# EAGLE design LOXpixel (EAGLE 9.3.0)
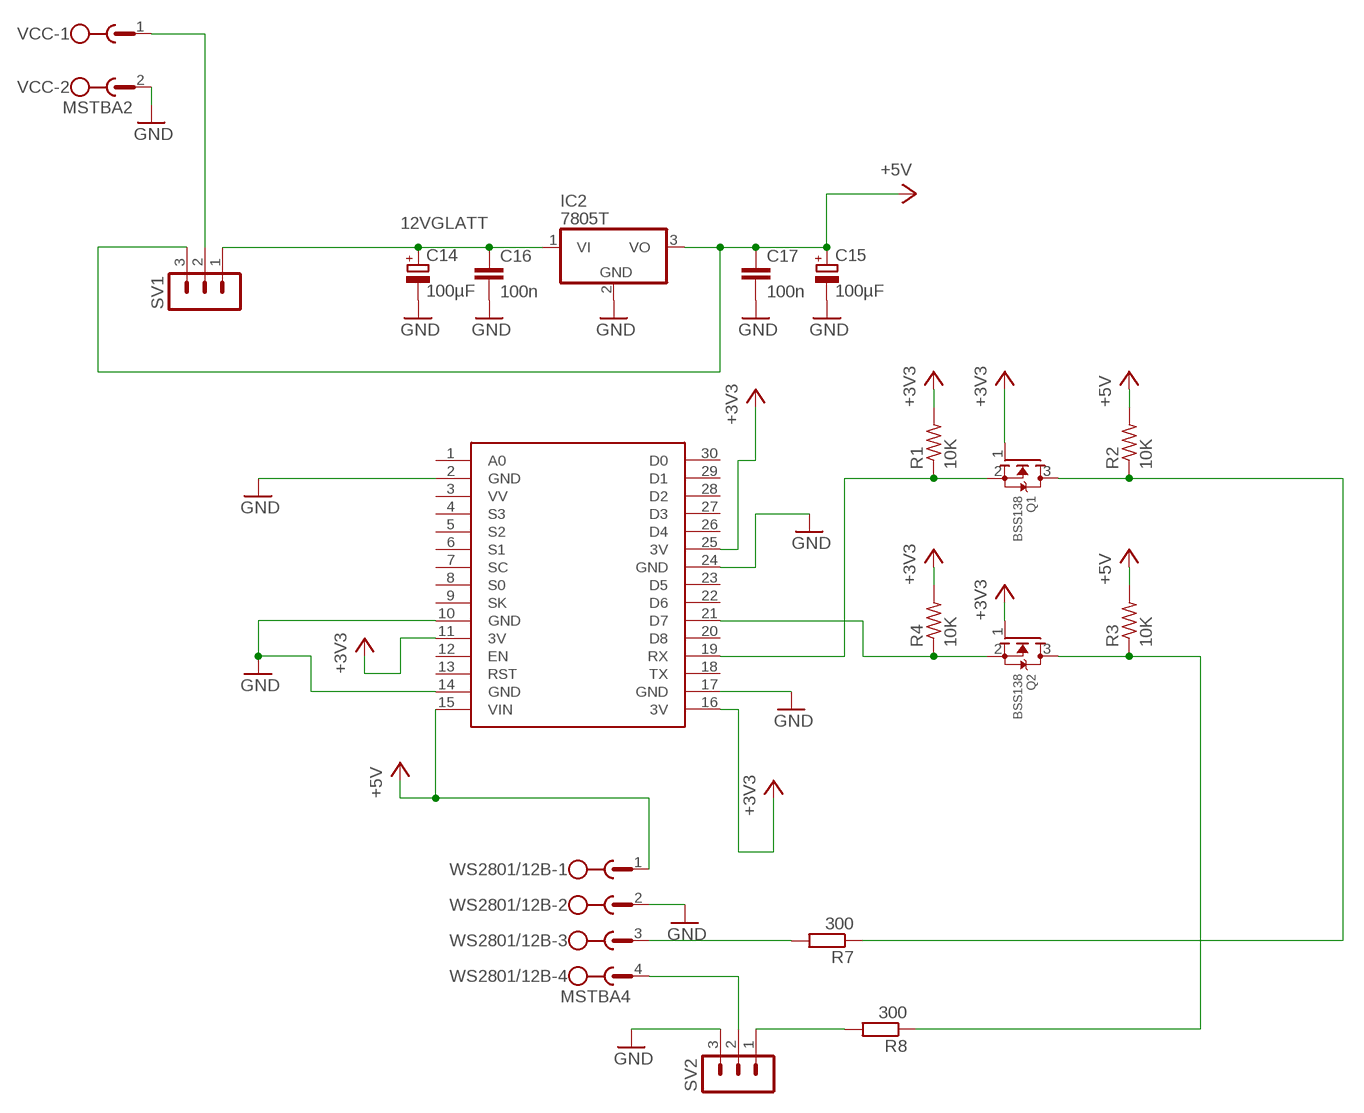
[diagram p0: schematic, sheet 1]

## Parts
C14  100µF  CPOL-EU150CLZ-0810  [150CLZ-0810]
C15  100µF  CPOL-EU150CLZ-0810  [150CLZ-0810]
C16  100n  C-EUC0805  [C0805]
C17  100n  C-EUC0805  [C0805]
IC2  7805T  [TO220H]
Q1  BSS138  MOSFET-NREFLOW  [SOT23]
Q2  BSS138  MOSFET-NREFLOW  [SOT23]
R1  10K  R-US_R0805  [R0805]
R2  10K  R-US_R0805  [R0805]
R3  10K  R-US_R0805  [R0805]
R4  10K  R-US_R0805  [R0805]
R7  300  R-EU_R0805  [R0805]
R8  300  R-EU_R0805  [R0805]
SV1  MA03-1  [MA03-1]
SV2  MA03-1  [MA03-1]
U$1  NODEMCU  [NODEMCU]
VCC  MSTBA2  [MSTBA2]
WS2801/12B  MSTBA4  [MSTBA4]

## Nets
12VGLATT: C14.+ C16.1 IC2.1(VI) SV1.1
+3V3: Q1.1(G) Q2.1(G) R1.2 R4.2 U$1.11(3V) U$1.16(3V) U$1.25(3V)
+5V: C15.+ C17.1 IC2.3(VO) R2.2 R3.2 SV1.3 U$1.15(VIN) WS2801/12B.1
GND: C14.- C15.- C16.2 C17.2 IC2.2(GND) SV2.3 U$1.2(GND) U$1.10(GND) U$1.14(GND) U$1.17(GND) U$1.24(GND) VCC.2 WS2801/12B.2
N$2: SV1.2 VCC.1
N$4: SV2.2 WS2801/12B.4
N$5: R8.2 SV2.1
N$6: R7.2 WS2801/12B.3
N$7: Q1.2(S) R1.1 U$1.19(RX)
N$8: Q1.3(D) R2.1 R7.1
N$11: Q2.2(S) R4.1 U$1.21(D7)
N$12: Q2.3(D) R3.1 R8.1
Unconnected: U$1.1(A0) U$1.3(VV) U$1.4(S3) U$1.5(S2) U$1.6(S1) U$1.7(SC) U$1.8(S0) U$1.9(SK) U$1.12(EN) U$1.13(RST) U$1.18(TX) U$1.20(D8) U$1.22(D6) U$1.23(D5) U$1.26(D4) U$1.27(D3) U$1.28(D2) U$1.29(D1) U$1.30(D0)

## Library data of the parts
C14 C15 = rcl:CPOL-EU: POLARIZED CAPACITOR, European symbol
C16 C17 = rcl:C-EU: CAPACITOR, European symbol
IC2 = linear:78*: Positive VOLTAGE REGULATOR Source: http://cache.national.com/ds/LM/LM78L05.pdf http://www.fairchildsemi.com/ds/LM/LM7805.pdf
Q1 Q2 = adafruit:MOSFET-N: N-Channel Mosfet 2N7002E - 60V 260mA SOT23 [Digikey: 2N7002ET1GOSTR-ND] - REEL BSH103 - 30V 850mA SOT23 [Digikey: 568-5013-1-ND]
R1-R4 = adafruit:R-US_: RESISTOR, American symbol
R7 R8 = rcl:R-EU_: RESISTOR, European symbol
SV1 SV2 = con-lstb:MA03-1: PIN HEADER; OC_FARNELL: unknown; OC_NEWARK: unknown
U$1 = nodemcu:NODEMCU
VCC = con-phoenix-508:MSTBA2: PHOENIX; MF: FARNELL; MPN: 1757242; OC_FARNELL: 3705171; OC_NEWARK: 71C4161
WS2801/12B = con-phoenix-508:MSTBA4: PHOENIX; MF: FARNELL; MPN: 1757268; OC_FARNELL: 3705195; OC_NEWARK: 71C4163

## Board
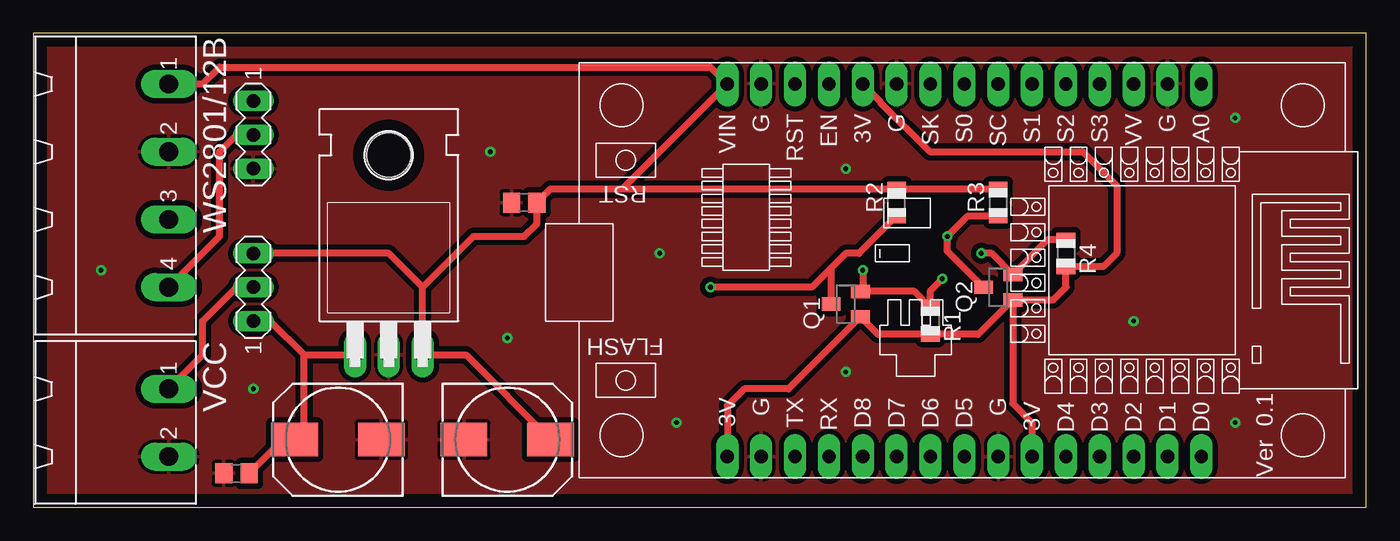
[diagram p1: board, top side]
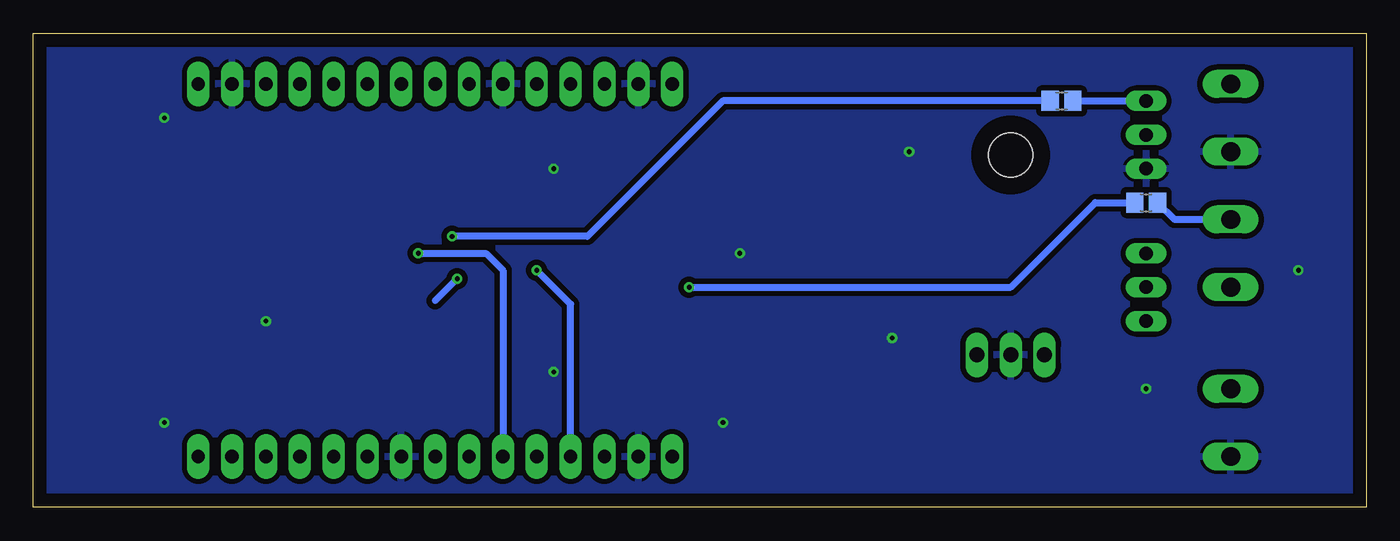
[diagram p2: board, bottom side, seen from below]

Size 100 x 35.55 mm. Coordinates in mm from the lower left corner, seen from the top.
Outline: 0,0 100,0 100,35.55 0,35.55 0,0
Copper layers (1*16): Top 0.035mm / dielectric 1.5mm / Bottom 0.035mm
Design rules "default": minimum track width 6mil, minimum drill 0.35mm, track to track 6mil, track to pad 6mil, pad to pad 6mil, via to via 6mil, smd to smd 6mil, copper to edge 40mil, drill to drill 6mil, minimum pad ring 10mil, minimum via ring 8mil, stop-mask expansion 4mil, vias tented up to drill 0mil, thermal gap 10mil

### Footprints (pad centres in the part's own frame; a part is rotated, then mirrored left to right if it is on the bottom)
150CLZ-0810 = smd 3.5 x 2.5: + 3.25,0; - -3.25,0
C0805 = smd 1.3 x 1.5: 1 -0.95,0; 2 0.95,0
TO220H = drill 1.118 long: 1 -2.54,-10.16; 2 0,-10.16; 3 2.54,-10.16 | hole 3.302: 0,4.826
SOT23 = smd 1 x 1.4: 1 -0.95,-1.1; 2 0.95,-1.1; 3 0,1.1
R0805 = smd 1.1 x 1.4: 1 -1,0; 2 1,0
R0805' = smd 1.3 x 1.5: 1 -0.85,0; 2 0.85,0
MA03-1 = drill 1.016 long: 1 -2.54,0; 2 0,0; 3 2.54,0
NODEMCU = drill 1 pad 1.676 long: 1 -13.97,17.78; 2 -13.97,15.24; 3 -13.97,12.7; 4 -13.97,10.16; 5 -13.97,7.62; 6 -13.97,5.08; 7 -13.97,2.54; 8 -13.97,0; 9 -13.97,-2.54; 10 -13.97,-5.08; 11 -13.97,-7.62; 12 -13.97,-10.16; 13 -13.97,-12.7; 14 -13.97,-15.24; 15 -13.97,-17.78; 16 13.97,-17.78; 17 13.97,-15.24; 18 13.97,-12.7; 19 13.97,-10.16; 20 13.97,-7.62; 21 13.97,-5.08; 22 13.97,-2.54; 23 13.97,0; 24 13.97,2.54; 25 13.97,5.08; 26 13.97,7.62; 27 13.97,10.16; 28 13.97,12.7; 29 13.97,15.24; 30 13.97,17.78
MSTBA2 = drill 1.397 long: 1 -2.54,5.08; 2 2.54,5.08
MSTBA4 = drill 1.397 long: 1 -7.62,5.08; 2 -2.54,5.08; 3 2.54,5.08; 4 7.62,5.08

### Placement (x,y rotation side)
C14  22.86,5.08 180 top
C15  35.56,5.08 0 top
C16  15.24,2.54 180 top
C17  36.83,22.86 180 top
IC2  26.67,21.59 0 top
Q1  60.96,15.24 90 top
Q2  72.39,16.51 90 top
R1  67.31,13.97 270 top
R2  64.77,22.86 90 top
R3  72.39,22.86 90 top
R4  77.47,19.05 270 top
R7  300  [R0805']  16.51,22.86 0 bottom
R8  300  [R0805']  22.86,30.48 0 bottom
SV1  16.51,16.51 90 top
SV2  16.51,27.94 270 top
U$1  69.85,17.78 270 top
VCC  5.08,6.35 270 top
WS2801/12B  5.08,24.13 270 top

### Tracks (layer width: path | path; a pad name or v marks a point on that pad's centre or on a via)
12VGLATT
  Top 0.508: SV1.1 17.78,13.97 20.32,11.43 | 20.32,11.43 IC2.1 | C14.+ 19.96,5.43 | 19.96,5.43 20.32,5.79 20.32,11.43 | C16.1 19.09,5.43 19.96,5.43
+3V3
  Top 0.508: Q2.1 73.49,7.79 74.93,6.35 U$1.25 | Q2.1 70.9,12.97 R1.2 63.38,12.97 Q1.1 56.66,8.89 53.34,8.89 52.07,7.62 U$1.16 | Q2.1 76.52,15.56 77.47,16.51 R4.2 80.28,18.05 81.28,19.05 81.28,24.13 78.74,26.67 67.25,26.67 63.52,30.4 63.52,30.45 U$1.11
+5V
  Top 0.508: R3.2 R2.2 44.18,23.86 | C15.+ 32.46,11.43 IC2.3 29.21,16.51 | 29.21,16.51 26.67,19.05 SV1.3 | 29.21,16.51 33.02,20.32 36.83,20.32 37.78,21.27 C17.1 38.78,23.86 43.18,23.86 44.18,23.86 | WS2801/12B.1 12.7,31.75 13.97,33.02 50.8,33.02 U$1.15 44.18,23.86
GND  (via drill 0.35)
  other vias: 16.51,8.89 5.08,17.78 34.29,26.67 35.56,12.7 48.26,6.35 46.99,19.05 60.96,25.4 60.96,10.16 82.55,13.97 90.17,6.35 90.17,29.21
  pour Top (isolate 0.406): 0,35.56 0,0 99.95,0 99.95,35.56
  pour Bottom (isolate 0.406): 0,35.56 0,0 99.95,0 99.95,35.56
N$2
  Top 0.508: VCC.1 12.7,11.43 12.7,13.97 15.24,16.51 SV1.2
N$4
  Top 0.508: WS2801/12B.4 13.97,20.32 13.97,26.67 15.24,27.94 SV2.2
N$5
  Bottom 0.508: R8.2 SV2.1
N$6
  Bottom 0.508: R7.2 14.39,21.59 WS2801/12B.3
N$7  (via drill 0.35)
  Top 0.508: 62.23,16.19 66.09,16.19 R1.1 67.31,16.26 v68.2,17.14 | 62.23,16.19 Q1.2 | v62.23,17.78 62.23,16.19
  Bottom 0.508: v68.2,17.14 69.85,15.49 | U$1.19 59.69,15.24 v62.23,17.78
N$8  (via drill 0.35)
  Top 0.508: R2.1 61.96,19.05 60.96,19.05 59.86,17.95 | 59.86,17.95 Q1.3 | 59.86,17.95 58.42,16.51 v50.8,16.51
  Bottom 0.508: v50.8,16.51 26.67,16.51 20.32,22.86 R7.1
N$11  (via drill 0.35)
  Top 0.508: R4.1 76.08,20.05 Q2.2 71.9,19.05 v71.12,19.05
  Bottom 0.508: v71.12,19.05 66.04,19.05 64.77,17.78 U$1.21
N$12  (via drill 0.35)
  Top 0.508: R3.1 70.12,21.86 v68.58,20.32 68.58,19.22 Q2.3
  Bottom 0.508: v68.58,20.32 58.42,20.32 48.26,30.48 R8.1

### Text on the board
bValues: www.unser-smartes-zuhause.de | [LOXpixel!]